# Altium schematic sheet can_transciever.SchDoc
size A4
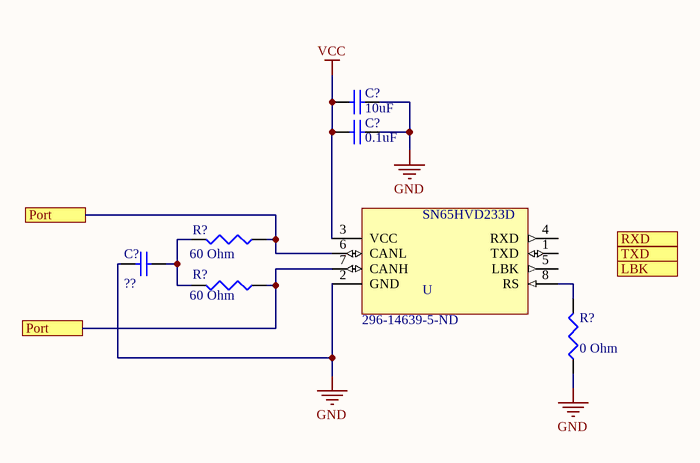
[diagram p0: can_transciever.SchDoc]

## Parts
(Parts that share a designator on the sheet are numbered #1, #2 ... from top to bottom, then left to right.)
C?#1  value 10uF  [C1206]  (hidden comment: Cap Semi)
C?#2  value 0.1uF  [C1206]  (hidden comment: Cap Semi)
C?#3  value ??  [C1206]  (hidden comment: Ceramic)
R?#1  value 60 Ohm  [J1-0603]  (hidden comment: 0603)
R?#2  value 60 Ohm  [J1-0603]  (hidden comment: 0603)
R?#3  value 0 Ohm  [J1-0603]
U  SN65HVD233D  Supplier Part Number 1: 296-14639-5-ND  [SOIC8]

## Ports
LBK, Port, RXD, TXD

## Nets
GND: C?#1.1 C?#2.1 C?#3.1 R?#3.1 U.2(GND)
VCC: C?#1.2 C?#2.2 U.3(VCC)
Port: R?#1.1 R?#2.1 U.6(CANL) U.7(CANH) ; port Port
NetC?#3_2: C?#3.2 R?#1.2 R?#2.2
NetR?#3_2: R?#3.2 U.8(RS)

Not connected (* = marked no-connect by the designer): U 1(TXD) 4(RXD) 5(LBK)

## Library data of the parts
C?#1-C?#3 = Cap Semi: Capacitor (Semiconductor SIM Model); Published: 8-Jun-2000; LatestRevisionDate: 29-May-2009; LatestRevisionNote: IPC-7351 Footprint Added.; PackageReference: C1206; Publisher: Altium Limited; PackageDescription: Chip Capacitor
R?#1-R?#3 = Res3: Resistor; Published: 8-Jun-2000; LatestRevisionDate: 29-May-2009; LatestRevisionNote: IPC-7351 Footprint Added.; PackageReference: J1-0603; Publisher: Altium Limited; PackageDescription: Chip Resistor
U = SN65HVD233D: 3.3V CAN Transceiver with Standby Mode, Loop-back 8-SOIC -40 to 125; MF: Texas Instruments; MP: SN65HVD233D; Package: SOIC-8 Texas Instruments; Availability: Good; SnapEDA_Link: https://www.snapeda.com/parts/SN65HVD233D/Texas%20Instruments/view-part/?ref=snap; Price: 2.39 USD; Value: *; Supplier 1: Digi-Key